# Altium schematic sheet crystal_oscillator_low_freq.SchDoc
size A4
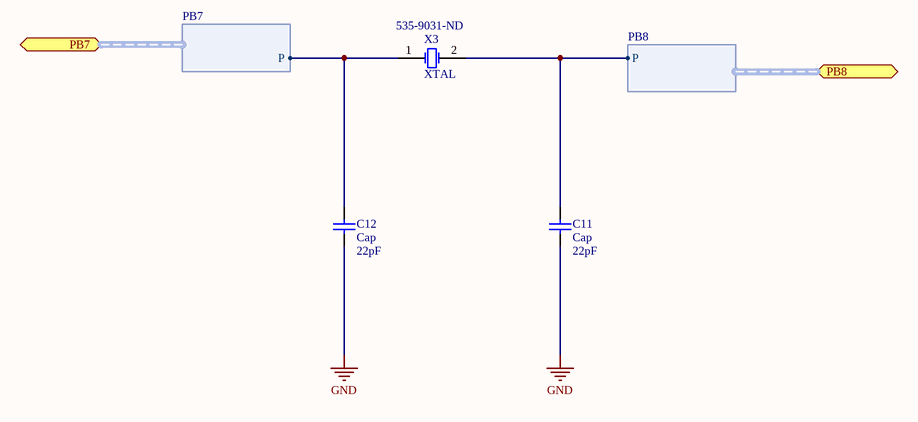
[diagram p0: crystal_oscillator_low_freq.SchDoc]

## Parts
C11  Cap  value 22pF  [RAD-0.3]
C12  Cap  value 22pF  [RAD-0.3]
X3  XTAL  Supplier Part Number 1: 535-9031-ND  [R38]

## Ports
PB7 (harness PB7), PB8 (harness PB8)

## Harnesses
PB7: P
PB8: P

## Nets
GND: C11.1 C12.1
NetC11_2: C11.2 X3.2(OSC2) ; port PB8.P
NetC12_2: C12.2 X3.1(OSC1) ; port PB7.P

## Library data of the parts
C11 C12 = Cap: Capacitor; Published: 8-Jun-2000; LatestRevisionDate: 17-Jul-2002; LatestRevisionNote: Re-released for DXP Platform.; PackageReference: RAD-0.3; Publisher: Altium Limited; PackageDescription: Radial Cap, Thru-Hole; 2 Leads; 0.3 in Pin Spacing
X3 = XTAL: Crystal Oscillator; Manufacturer: Abracon Corporation; Manufacturer Part Number: AB15T-32.768KHZ; Description: CRYSTAL 32.768KHZ 12.5PF THRU; Frequency: 32.768kHz; Frequency Tolerance: ±20ppm; Load Capacitance: 12.5pF; ESR (Equivalent Series Resistance): 40 kOhm; Operating Mode: Fundamental; Published: 8-Jun-2000; LatestRevisionDate: 17-Jul-2002; LatestRevisionNote: Re-released for DXP Platform.; PackageReference: R38; Publisher: Altium Limited; PackageDescription: Crystal, Thru-Hole; 2 Leads; Body 3.1 x 8.2 mm (Dia.xH); Supplier 1: Digi-Key; RoHS: RoHS Compliant; Category: Crystals and Oscillators; Stock 1: 860; Pricing 1: 1=0.94, 10=0.896, 50=0.8754, 100=0.7504, 500=0.72958, 750=0.66704, 1000=0.61493, 2500=0.58366, 5000=0.56282 (EUR); Packaging: Bulk; Type: kHz Crystal (Tuning Fork); Frequency Stability: -; Operating Temperature: -20°C ~ 70°C; Ratings: -; Mounting Type: Through Hole; Package / Case: Cylindrical Can, Radial; Size / Dimension: 0.055" Dia x 0.197" L (1.40mm x 5.00mm); Height: 0.201" (5.10mm); ComponentLink1URL: http://www.abracon.com/Resonators/AB15T.pdf; ComponentLink1Description: http://www.abracon.com/Resonators/AB15T.pdf